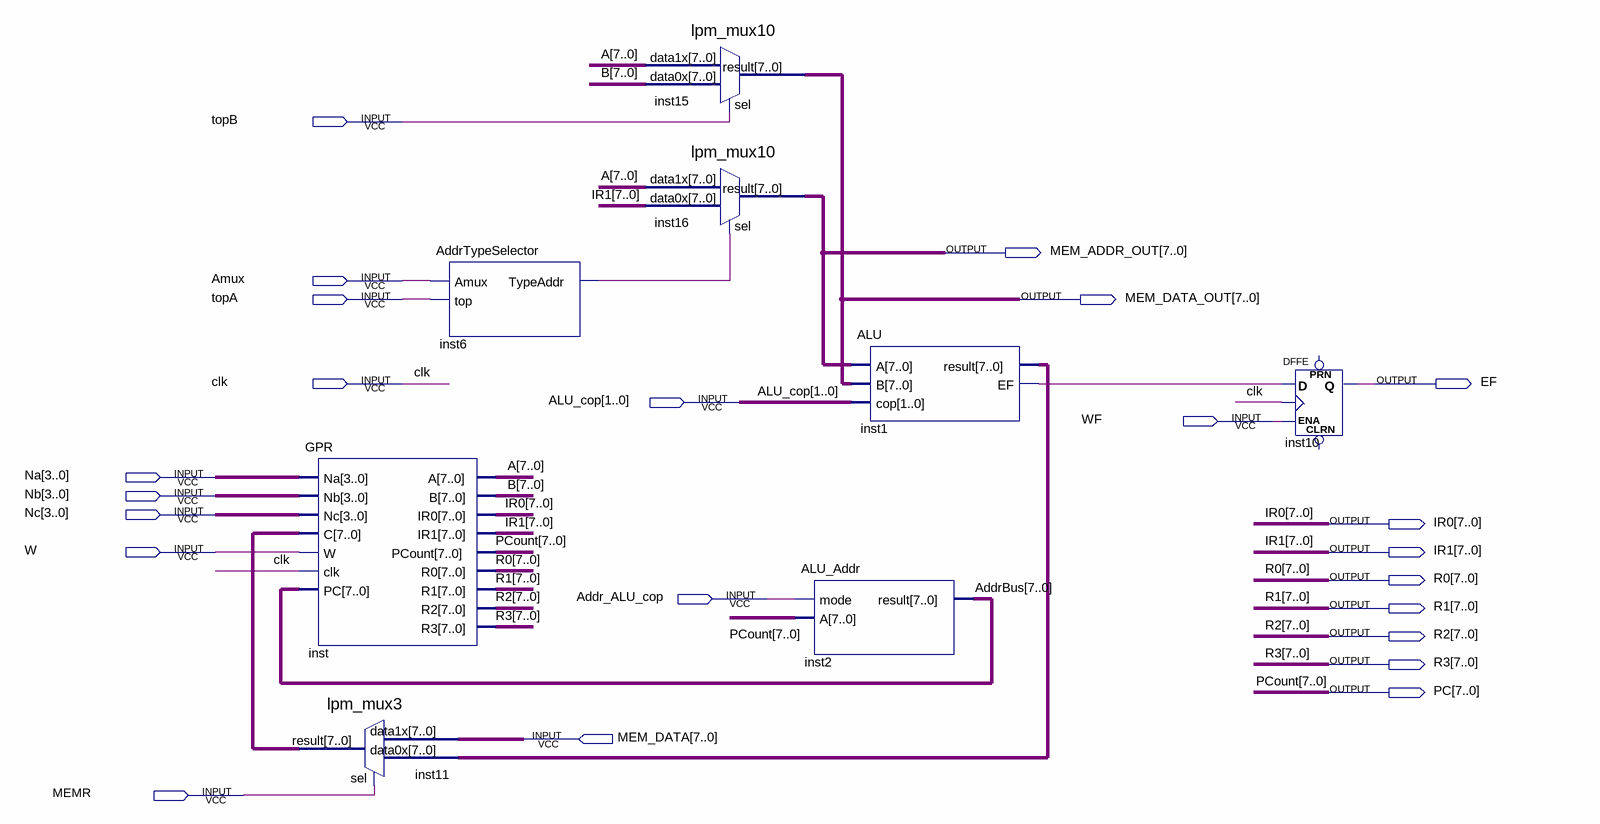
[diagram p0: schematic sheet]
// Quartus schematic OU.bdf as structural Verilog: 8 symbols, 23 pins
module OU (
  input  topB,
  input  Amux,
  input  topA,
  input  clk,
  input  [1:0] ALU_cop,
  input  WF,
  input  [3:0] Na,
  input  [3:0] Nb,
  input  [3:0] Nc,
  input  W,
  input  Addr_ALU_cop,
  input  [7:0] MEM_DATA,
  input  MEMR,
  output [7:0] MEM_ADDR_OUT,
  output [7:0] MEM_DATA_OUT,
  output EF,
  output [7:0] IR0,
  output [7:0] IR1,
  output [7:0] R0,
  output [7:0] R1,
  output [7:0] R2,
  output [7:0] R3,
  output [7:0] PC
);

  wire inst1_ef, inst6_typeaddr;
  wire [7:0] A, AddrBus, B, inst1_result, inst11_result;

  GPR inst (
    .Na(Na), .Nb(Nb), .Nc(Nc), .C(inst11_result), .W(W), .clk(clk), .PC(AddrBus), .A(A), .B(B), .IR0(IR0),
    .IR1(IR1), .PCount(PC), .R0(R0), .R1(R1), .R2(R2), .R3(R3));
  lpm_mux3 inst11 (.data1x(MEM_DATA), .data0x(inst1_result), .sel(MEMR), .result(inst11_result));
  AddrTypeSelector inst6 (.Amux(Amux), .top(topA), .TypeAddr(inst6_typeaddr));
  lpm_mux10 inst15 (.data1x(A), .data0x(B), .sel(topB), .result(MEM_DATA_OUT));
  lpm_mux10 inst16 (.data1x(A), .data0x(IR1), .sel(inst6_typeaddr), .result(MEM_ADDR_OUT));
  ALU_Addr inst2 (.mode(Addr_ALU_cop), .A(PC), .result(AddrBus));
  ALU inst1 (.A(MEM_ADDR_OUT), .B(MEM_DATA_OUT), .cop(ALU_cop), .result(inst1_result), .EF(inst1_ef));
  DFFE inst10 (.D(inst1_ef), .CLK(clk), .ENA(WF), .Q(EF));  // open: PRN, CLRN

  // Other names for the same wires on the sheet: PCount[7:0] = PC
endmodule
